# Altium schematic sheet 三极管放大电路.SchDoc
size A4; SheetNumber: 1; SheetTotal: 1; SPICEModelCacheKMTYUMAV: <root> / <DocumentId>KMTYUMAV</DocumentId> / <CacheFrame Number="0"> / <Model Name="npn" Kind="MDL"> / <Text>*Default NPN BJT / *NPN Trans Pinout: C,B,E / .MODEL NPN NPN()</Text> / </Model> / </CacheFrame> / </root>
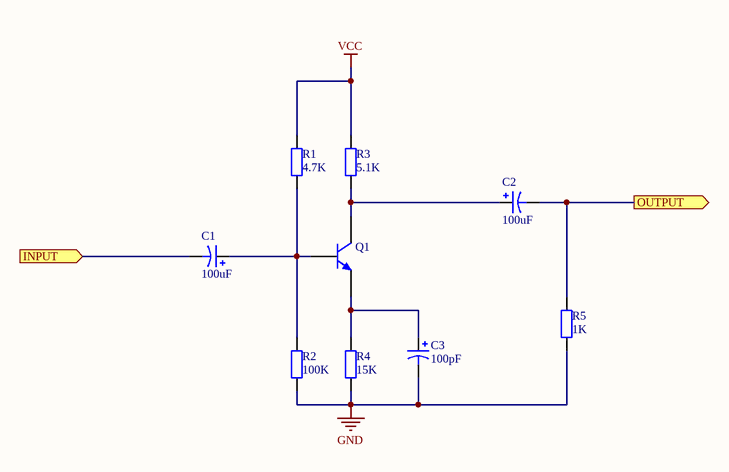
[diagram p0: 三极管放大电路.SchDoc]

## Parts
C1  value 100uF  [RB7.6-15]  (hidden comment: Cap Pol1)
C2  value 100uF  [RB7.6-15]  (hidden comment: Cap Pol1)
C3  value 100pF  [RB7.6-15]  (hidden comment: Cap Pol1)
Q1  NPN  [TO-226-AA]  (value not drawn)
R1  value 4.7K  [AXIAL-0.4]  (hidden comment: Res2)
R2  value 100K  [AXIAL-0.4]  (hidden comment: Res2)
R3  value 5.1K  [AXIAL-0.4]  (hidden comment: Res2)
R4  value 15K  [AXIAL-0.4]  (hidden comment: Res2)
R5  value 1K  [AXIAL-0.4]  (hidden comment: Res2)

## Ports
INPUT (in), OUTPUT (out)

## Nets
GND: C3.2 R2.1 R4.1 R5.1
VCC: R1.2 R3.2
INPUT: C1.2 ; port INPUT
OUTPUT: C2.2 R5.2 ; port OUTPUT
NetC1_1: C1.1 Q1.2(B) R1.1 R2.2
NetC2_1: C2.1 Q1.1(C) R3.1
NetC3_1: C3.1 Q1.3(E) R4.2

## Library data of the parts
C1-C3 = Cap Pol1: Polarized Capacitor (Radial); Published: 8-Jun-2000; LatestRevisionDate: 17-Jul-2002; LatestRevisionNote: Re-released for DXP Platform.; PackageReference: RB7.6-15; Publisher: Altium Limited; PackageDescription: Polarized Capacitor (Radial); 2 Leads
Q1 = NPN: NPN Bipolar Transistor; Published: 8-Jun-2000; LatestRevisionDate: 17-Jul-2002; LatestRevisionNote: Re-released for DXP Platform.; PackageReference: TO-226-AA; Publisher: Altium Limited; PackageDescription: TO, Flat Index; 3 In-Line, Axial Leads; Body Dia. 4.8mm; Leads 0.55 x 0.51 mm (max); Code_JEDEC: TO-226-AA
R1-R5 = Res2: Resistor; Published: 8-Jun-2000; LatestRevisionDate: 17-Jul-2002; LatestRevisionNote: Re-released for DXP Platform.; PackageReference: AXIAL-0.4; Publisher: Altium Limited; PackageDescription: Axial Device, Thru-Hole; 2 Leads; 0.4 in Pin Spacing